# EAGLE design M228X (EAGLE 6.6.0)
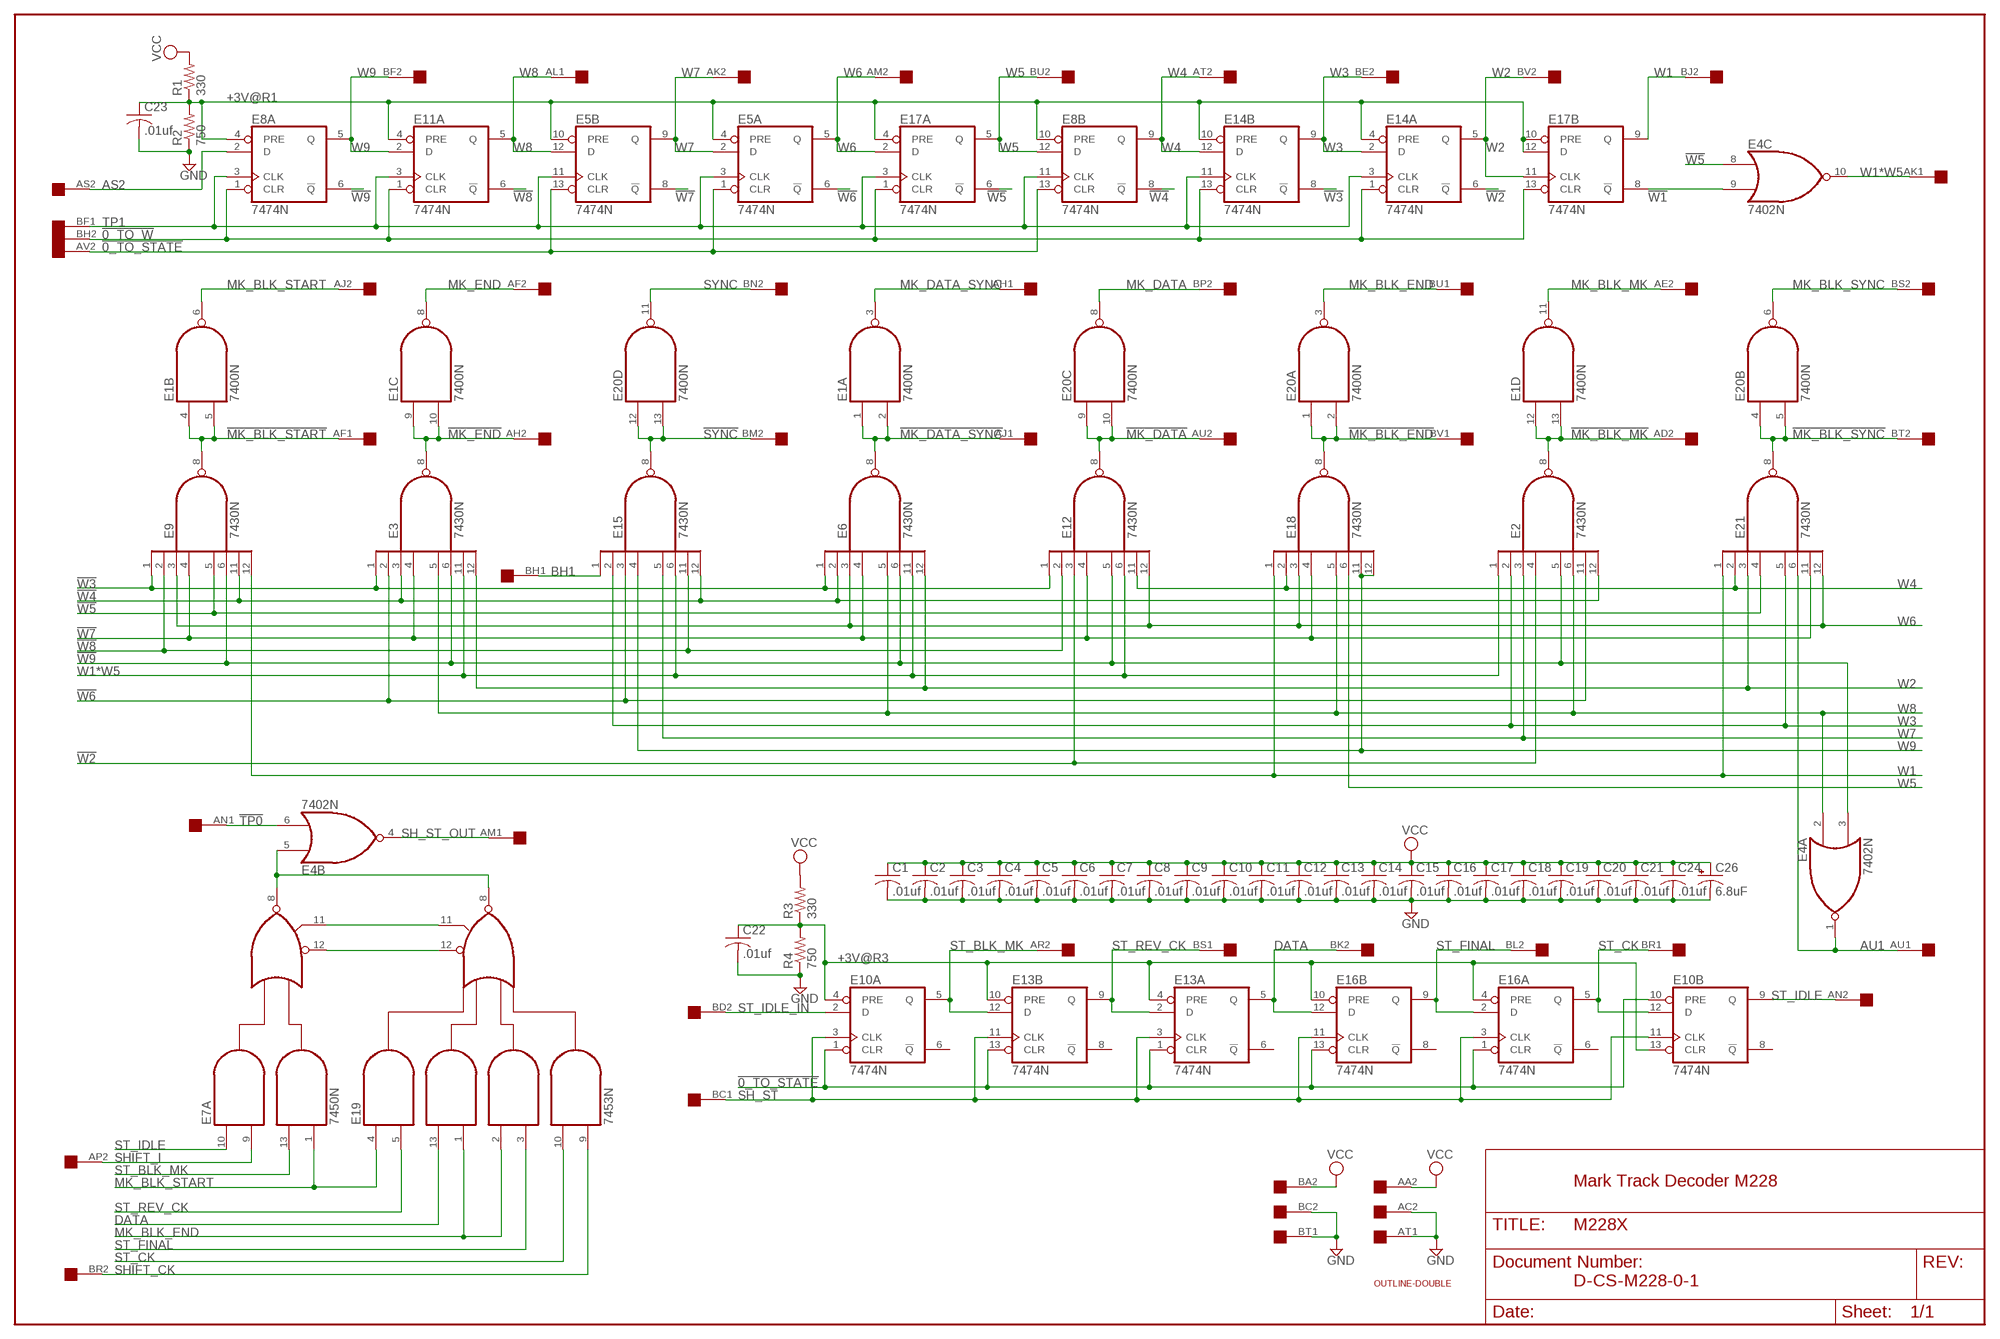
[diagram p0: schematic, sheet 1]

## Parts
C1  .01uf  C-US050-025X075  [C050-025X075]
C2  .01uf  C-US050-025X075  [C050-025X075]
C3  .01uf  C-US050-025X075  [C050-025X075]
C4  .01uf  C-US050-025X075  [C050-025X075]
C5  .01uf  C-US050-025X075  [C050-025X075]
C6  .01uf  C-US050-025X075  [C050-025X075]
C7  .01uf  C-US050-025X075  [C050-025X075]
C8  .01uf  C-US050-025X075  [C050-025X075]
C9  .01uf  C-US050-025X075  [C050-025X075]
C10  .01uf  C-US050-025X075  [C050-025X075]
C11  .01uf  C-US050-025X075  [C050-025X075]
C12  .01uf  C-US050-025X075  [C050-025X075]
C13  .01uf  C-US050-025X075  [C050-025X075]
C14  .01uf  C-US050-025X075  [C050-025X075]
C15  .01uf  C-US050-025X075  [C050-025X075]
C16  .01uf  C-US050-025X075  [C050-025X075]
C17  .01uf  C-US050-025X075  [C050-025X075]
C18  .01uf  C-US050-025X075  [C050-025X075]
C19  .01uf  C-US050-025X075  [C050-025X075]
C20  .01uf  C-US050-025X075  [C050-025X075]
C21  .01uf  C-US050-025X075  [C050-025X075]
C22  .01uf  C-US050-025X075  [C050-025X075]
C23  .01uf  C-US050-025X075  [C050-025X075]
C24  .01uf  C-US050-025X075  [C050-025X075]
C26  6.8uF  CPOL-USE22-6AXIAL  [E22-6]
E1  7400N  [DIL14]
E2  7430N  [DIL14]
E3  7430N  [DIL14]
E4  7402N  [DIL14]
E5  7474N  74S74N  [DIL14]
E6  7430N  [DIL14]
E7  7450N  [DIL14]
E8  7474N  74S74N  [DIL14]
E9  7430N  [DIL14]
E10  7474N  74S74N  [DIL14]
E11  7474N  74S74N  [DIL14]
E12  7430N  [DIL14]
E13  7474N  74S74N  [DIL14]
E14  7474N  74S74N  [DIL14]
E15  7430N  [DIL14]
E16  7474N  74S74N  [DIL14]
E17  7474N  74S74N  [DIL14]
E18  7430N  [DIL14]
E19  7453N  [DIL14]
E20  7400N  [DIL14]
E21  7430N  [DIL14]
R1  330  R-US_0207/10  [0207/10]
R2  750  R-US_0207/10  [0207/10]
R3  330  R-US_0207/10  [0207/10]
R4  750  R-US_0207/10  [0207/10]
U$1  OUTLINE-DOUBLE  [DOUBLE]
U$5  DOUBLE  [EDGE-CON4]

## Nets
!0_TO_STATE: E5.1(A:CLR) E5.13(B:CLR) E8.13(B:CLR) E10.1(A:CLR) E10.10(B:PRE) E13.1(A:CLR) E13.13(B:CLR) E16.1(A:CLR) E16.13(B:CLR) U$5.AV2
!0_TO_W: E8.1(A:CLR) E11.1(A:CLR) E14.1(A:CLR) E14.13(B:CLR) E17.1(A:CLR) E17.13(B:CLR) U$5.BH2
!MK_BLK_END: E18.8(O) E20.1(A:I0) E20.2(A:I1) U$5.BV1
!MK_BLK_MK: E1.12(D:I0) E1.13(D:I1) E2.8(O) U$5.AD2
!MK_BLK_START: E1.4(B:I0) E1.5(B:I1) E9.8(O) U$5.AF1
!MK_BLK_SYNC: E20.4(B:I0) E20.5(B:I1) E21.8(O) U$5.BT2
!MK_DATA: E12.8(O) E20.9(C:I0) E20.10(C:I1) U$5.AU2
!MK_DATA_SYNC: E1.1(A:I0) E1.2(A:I1) E6.8(O) U$5.AJ1
!MK_END: E1.9(C:I0) E1.10(C:I1) E3.8(O) U$5.AH2
!SYNC: E15.8(O) E20.12(D:I0) E20.13(D:I1) U$5.BM2
!TP0: E4.6(B:I1) U$5.AN1
!W1: E4.9(C:I1) E17.8(B:!Q)
!W2: E2.4(I3) E12.3(I2) E14.6(A:!Q)
!W3: E3.1(I0) E6.1(I0) E9.1(I0) E12.1(I0) E14.8(B:!Q)
!W4: E2.12(I7) E3.3(I2) E6.2(I1) E8.8(B:!Q) E9.11(I6) E15.12(I7)
!W5: E4.8(C:I0) E9.5(I4) E17.6(A:!Q) E21.4(I3)
!W6: E2.11(I6) E3.2(I1) E5.6(A:!Q) E15.3(I2)
!W7: E3.4(I3) E5.8(B:!Q) E6.4(I3) E9.4(I3) E12.4(I3) E18.4(I3) E21.11(I6)
!W8: E9.2(I1) E11.6(A:!Q) E12.2(I1) E15.11(I6)
!W9: E2.5(I4) E3.6(I5) E4.3(A:I1) E6.6(I5) E8.6(A:!Q) E9.6(I5) E12.5(I4)
+3V@R1 [Supply]: C23.1 E5.4(A:PRE) E5.10(B:PRE) E8.4(A:PRE) E8.10(B:PRE) E11.4(A:PRE) E14.4(A:PRE) E14.10(B:PRE) E17.4(A:PRE) E17.10(B:PRE) E17.12(B:D) R1.1 R2.2
+3V@R3 [Supply]: C22.1 E10.4(A:PRE) E10.13(B:CLR) E13.4(A:PRE) E13.10(B:PRE) E16.4(A:PRE) E16.10(B:PRE) R3.1 R4.2
AS2: E8.2(A:D) U$5.AS2
AU1: E4.1(A:O) E21.6(I5) U$5.AU1
BH1: E15.1(I0) U$5.BH1
DATA: E13.5(A:Q) E16.12(B:D) E19.13(I3) U$5.BK2
GND [Supply]: C1.2 C2.2 C3.2 C4.2 C5.2 C6.2 C7.2 C8.2 C9.2 C10.2 C11.2 C12.2 C13.2 C14.2 C15.2 C16.2 C17.2 C18.2 C19.2 C20.2 C21.2 C22.2 C23.2 C24.2 C26.- R2.1 R4.1 U$5.AC2 U$5.AT1 U$5.BC2 U$5.BT1
MK_BLK_END: E19.1(I4) E19.2(I5) E20.3(A:O) U$5.BU1
MK_BLK_MK: E1.11(D:O) U$5.AE2
MK_BLK_START: E1.6(B:O) E7.1(A:I4) E19.4(I1) U$5.AJ2
MK_BLK_SYNC: E20.6(B:O) U$5.BS2
MK_DATA: E20.8(C:O) U$5.BP2
MK_DATA_SYNC: E1.3(A:O) U$5.AH1
MK_END: E1.8(C:O) U$5.AF2
N$1: E7.12(A:I5) E19.12(I9)
N$2: E7.11(A:I6) E19.11(I10)
N$3: E4.5(B:I0) E7.8(A:O) E19.8(O)
SH_ST: E10.3(A:CLK) E10.11(B:CLK) E13.3(A:CLK) E13.11(B:CLK) E16.3(A:CLK) E16.11(B:CLK) U$5.BC1
SH_ST_OUT: E4.4(B:O) U$5.AM1
SHIFT_CK: E19.9(I8) U$5.BR2
SHIFT_I: E7.9(A:I2) U$5.AP2
ST_BLK_MK: E7.13(A:I3) E10.5(A:Q) E13.12(B:D) U$5.AR2
ST_CK: E10.12(B:D) E16.5(A:Q) E19.10(I7) U$5.BR1
ST_FINAL: E16.2(A:D) E16.9(B:Q) E19.3(I6) U$5.BL2
ST_IDLE: E7.10(A:I1) E10.9(B:Q) U$5.AN2
ST_IDLE_IN: E10.2(A:D) U$5.BD2
ST_REV_CK: E13.2(A:D) E13.9(B:Q) E19.5(I2) U$5.BS1
SYNC: E20.11(D:O) U$5.BN2
TP1: E5.3(A:CLK) E5.11(B:CLK) E8.3(A:CLK) E8.11(B:CLK) E11.3(A:CLK) E14.3(A:CLK) E14.11(B:CLK) E17.3(A:CLK) U$5.BF1
VCC [Supply]: C1.1 C2.1 C3.1 C4.1 C5.1 C6.1 C7.1 C8.1 C9.1 C10.1 C11.1 C12.1 C13.1 C14.1 C15.1 C16.1 C17.1 C18.1 C19.1 C20.1 C21.1 C24.1 C26.+ R1.2 R3.2 U$5.AA2 U$5.BA2
W1: E9.12(I7) E17.9(B:Q) E18.1(I0) E21.1(I0) U$5.BJ2
W1*W5: E2.1(I0) E3.11(I6) E4.10(C:O) E6.11(I6) E12.6(I5) E15.6(I5) U$5.AK1
W2: E3.12(I7) E6.12(I7) E14.5(A:Q) E17.11(B:CLK) E21.3(I2) U$5.BV2
W3: E2.2(I1) E14.2(A:D) E14.9(B:Q) E15.2(I1) E21.5(I4) U$5.BE2
W4: E8.9(B:Q) E12.11(I6) E14.12(B:D) E18.2(I1) E21.2(I1) U$5.AT2
W5: E8.12(B:D) E17.5(A:Q) E18.6(I5) U$5.BU2
W6: E5.5(A:Q) E6.3(I2) E9.3(I2) E12.12(I7) E17.2(A:D) E18.3(I2) E21.12(I7) U$5.AM2
W7: E2.3(I2) E5.2(A:D) E5.9(B:Q) E15.5(I4) U$5.AK2
W8: E2.6(I5) E3.5(I4) E4.2(A:I0) E5.12(B:D) E6.5(I4) E11.5(A:Q) E18.5(I4) U$5.AL1
W9: E8.5(A:Q) E11.2(A:D) E15.4(I3) E18.11(I6) E18.12(I7) U$5.BF2
Unconnected: E4.11(D:I0) E4.12(D:I1) E4.13(D:O) E7.2(B:I1) E7.3(B:I2) E7.4(B:I3) E7.5(B:I4) E7.6(B:O) E10.6(A:!Q) E10.8(B:!Q) E11.8(B:!Q) E11.9(B:Q) E11.10(B:PRE) E11.11(B:CLK) E11.12(B:D) E11.13(B:CLR) E13.6(A:!Q) E13.8(B:!Q) E16.6(A:!Q) E16.8(B:!Q) U$5.AA1 U$5.AB1 U$5.AB2 U$5.AC1 U$5.AD1 U$5.AE1 U$5.AL2 U$5.AP1 U$5.AR1 U$5.AS1 U$5.AV1 U$5.BA1 U$5.BB1 U$5.BB2 U$5.BD1 U$5.BE1 U$5.BJ1 U$5.BK1 U$5.BL1 U$5.BM1 U$5.BN1 U$5.BP1

## Notes on the sheet
- Mark Track Decoder M228
- D-CS-M228-0-1

## Power pins joined to a net without a drawn wire
GND: E1.7(P:GND) E2.7(GND) E3.7(GND) E4.7(P:GND) E5.7(P:GND) E6.7(GND) E7.7(P:GND) E8.7(P:GND) E9.7(GND) E10.7(P:GND) E11.7(P:GND) E12.7(GND) E13.7(P:GND) E14.7(P:GND) E15.7(GND) E16.7(P:GND) E17.7(P:GND) E18.7(GND) E19.7(GND) E20.7(P:GND) E21.7(GND)
VCC: E1.14(P:VCC) E2.14(VCC) E3.14(VCC) E4.14(P:VCC) E5.14(P:VCC) E6.14(VCC) E7.14(P:VCC) E8.14(P:VCC) E9.14(VCC) E10.14(P:VCC) E11.14(P:VCC) E12.14(VCC) E13.14(P:VCC) E14.14(P:VCC) E15.14(VCC) E16.14(P:VCC) E17.14(P:VCC) E18.14(VCC) E19.14(VCC) E20.14(P:VCC) E21.14(VCC)

## Library data of the parts
C1-C24 = rcl:C-US: CAPACITOR, American symbol
C26 = rcl:CPOL-US: POLARIZED CAPACITOR, American symbol
E1 E20 = 74xx-us:74*00: Quad 2-input NAND gate
E2 E3 E6 E9 E12 E15 E18 E21 = 74xx-us:74*30: 8-input NAND gate
E4 = 74xx-us:74*02: Quad 2-input NOR gate
E5 E8 E10 E11 E13 E14 E16 E17 = 74xx-us:74*74: Dual D type positive edge triggered FLIP FLOP, preset and clear
E7 = dec-con:74*50: 4-2-3-2 input AND OR INVERTER gates
E19 = 74xxN:74*53: 4-2-3-2 input AND OR INVERTER gates
R1-R4 = rcl:R-US_: RESISTOR, American symbol
U$1 = dec-con:OUTLINE-*: Board outlines for DEC boards.
U$5 = dec-con:DOUBLE: Double-Height DEC board

## Net classes
1 Supply: width 0.813 mm

## Board
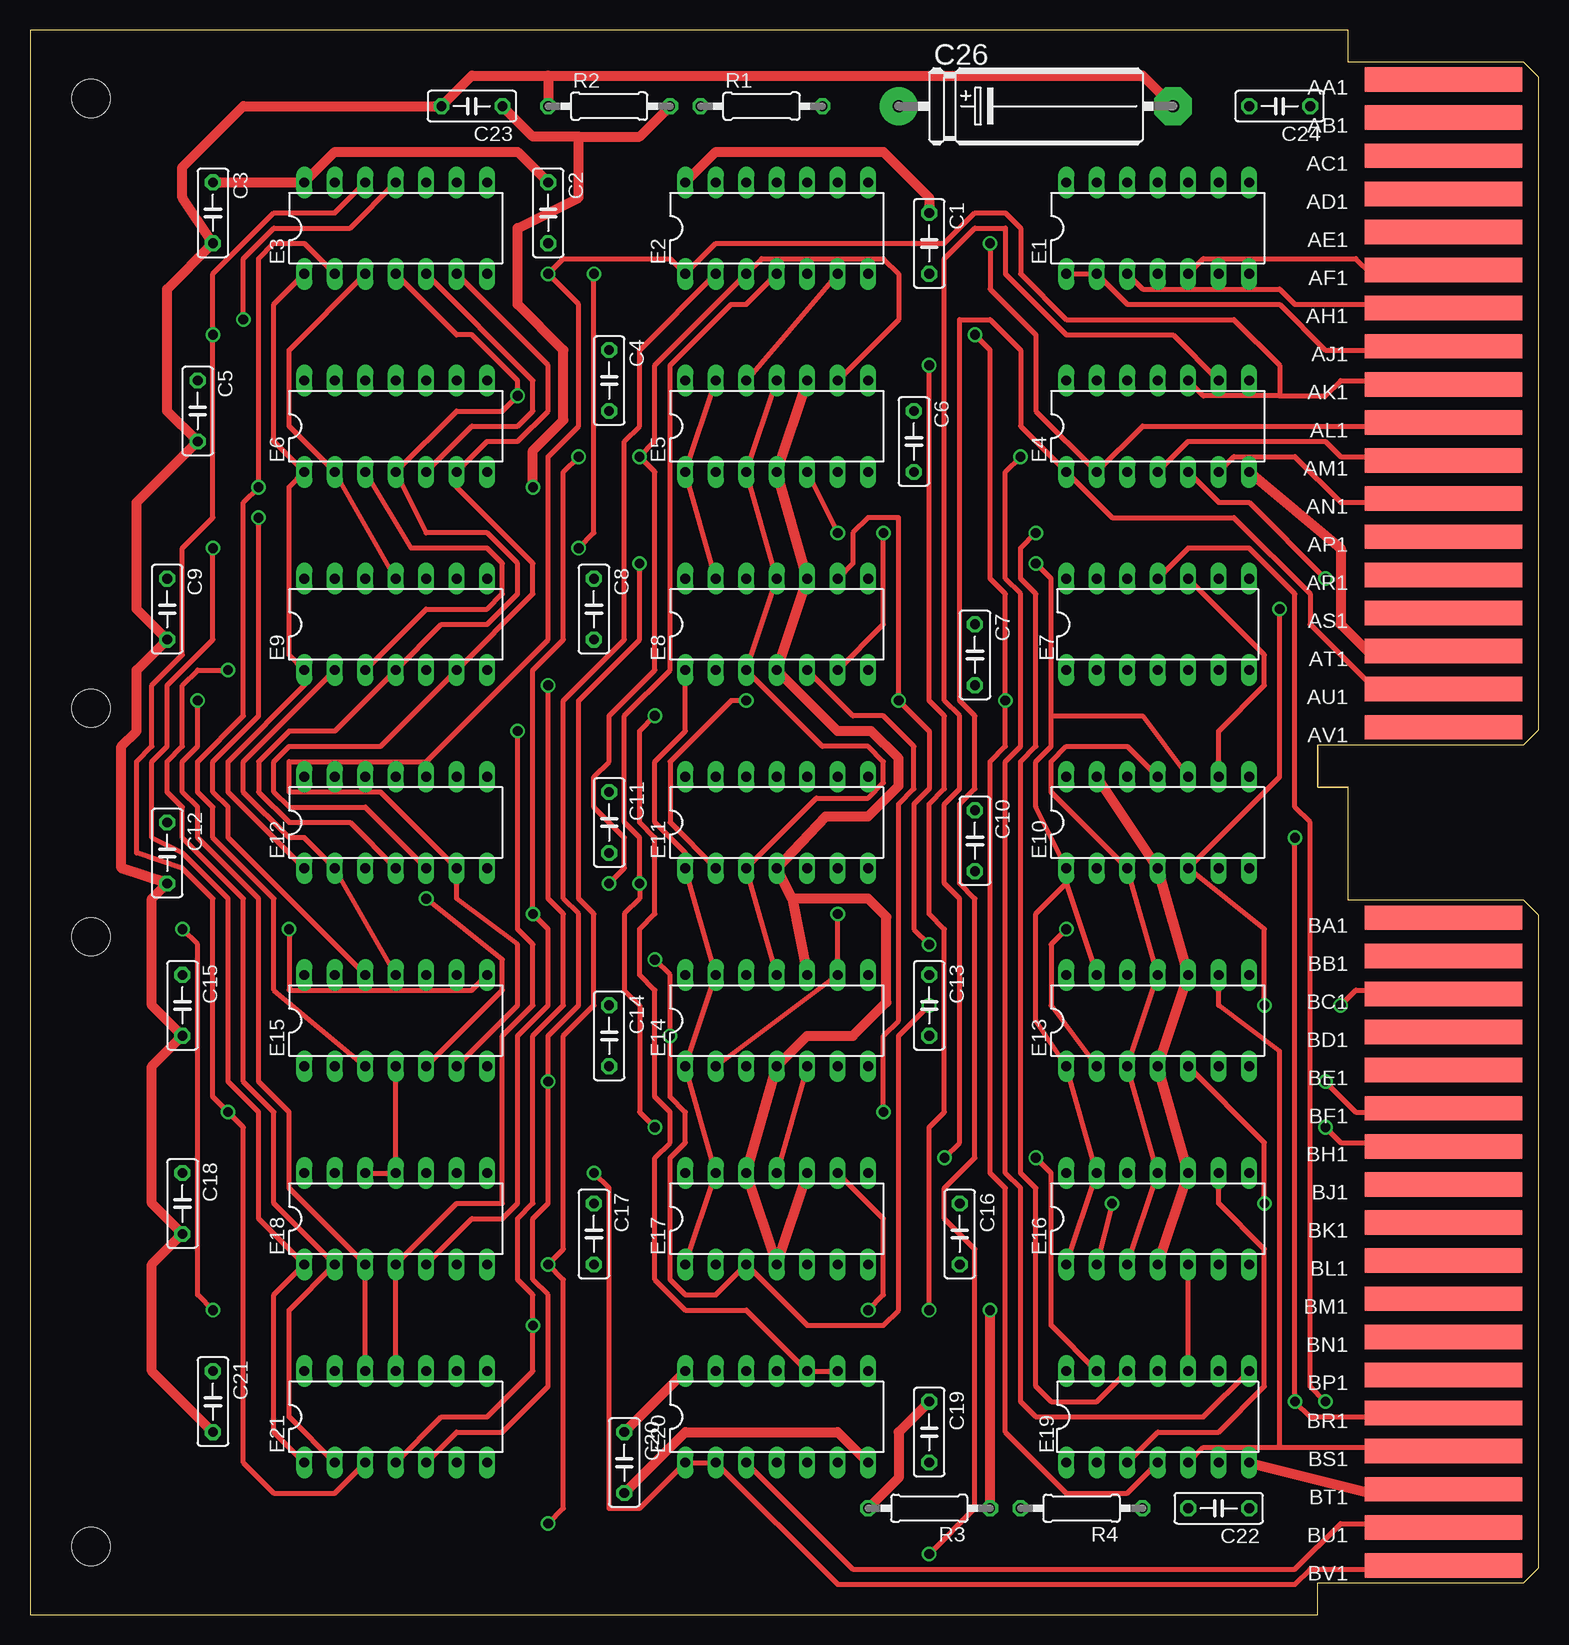
[diagram p1: board, top side]
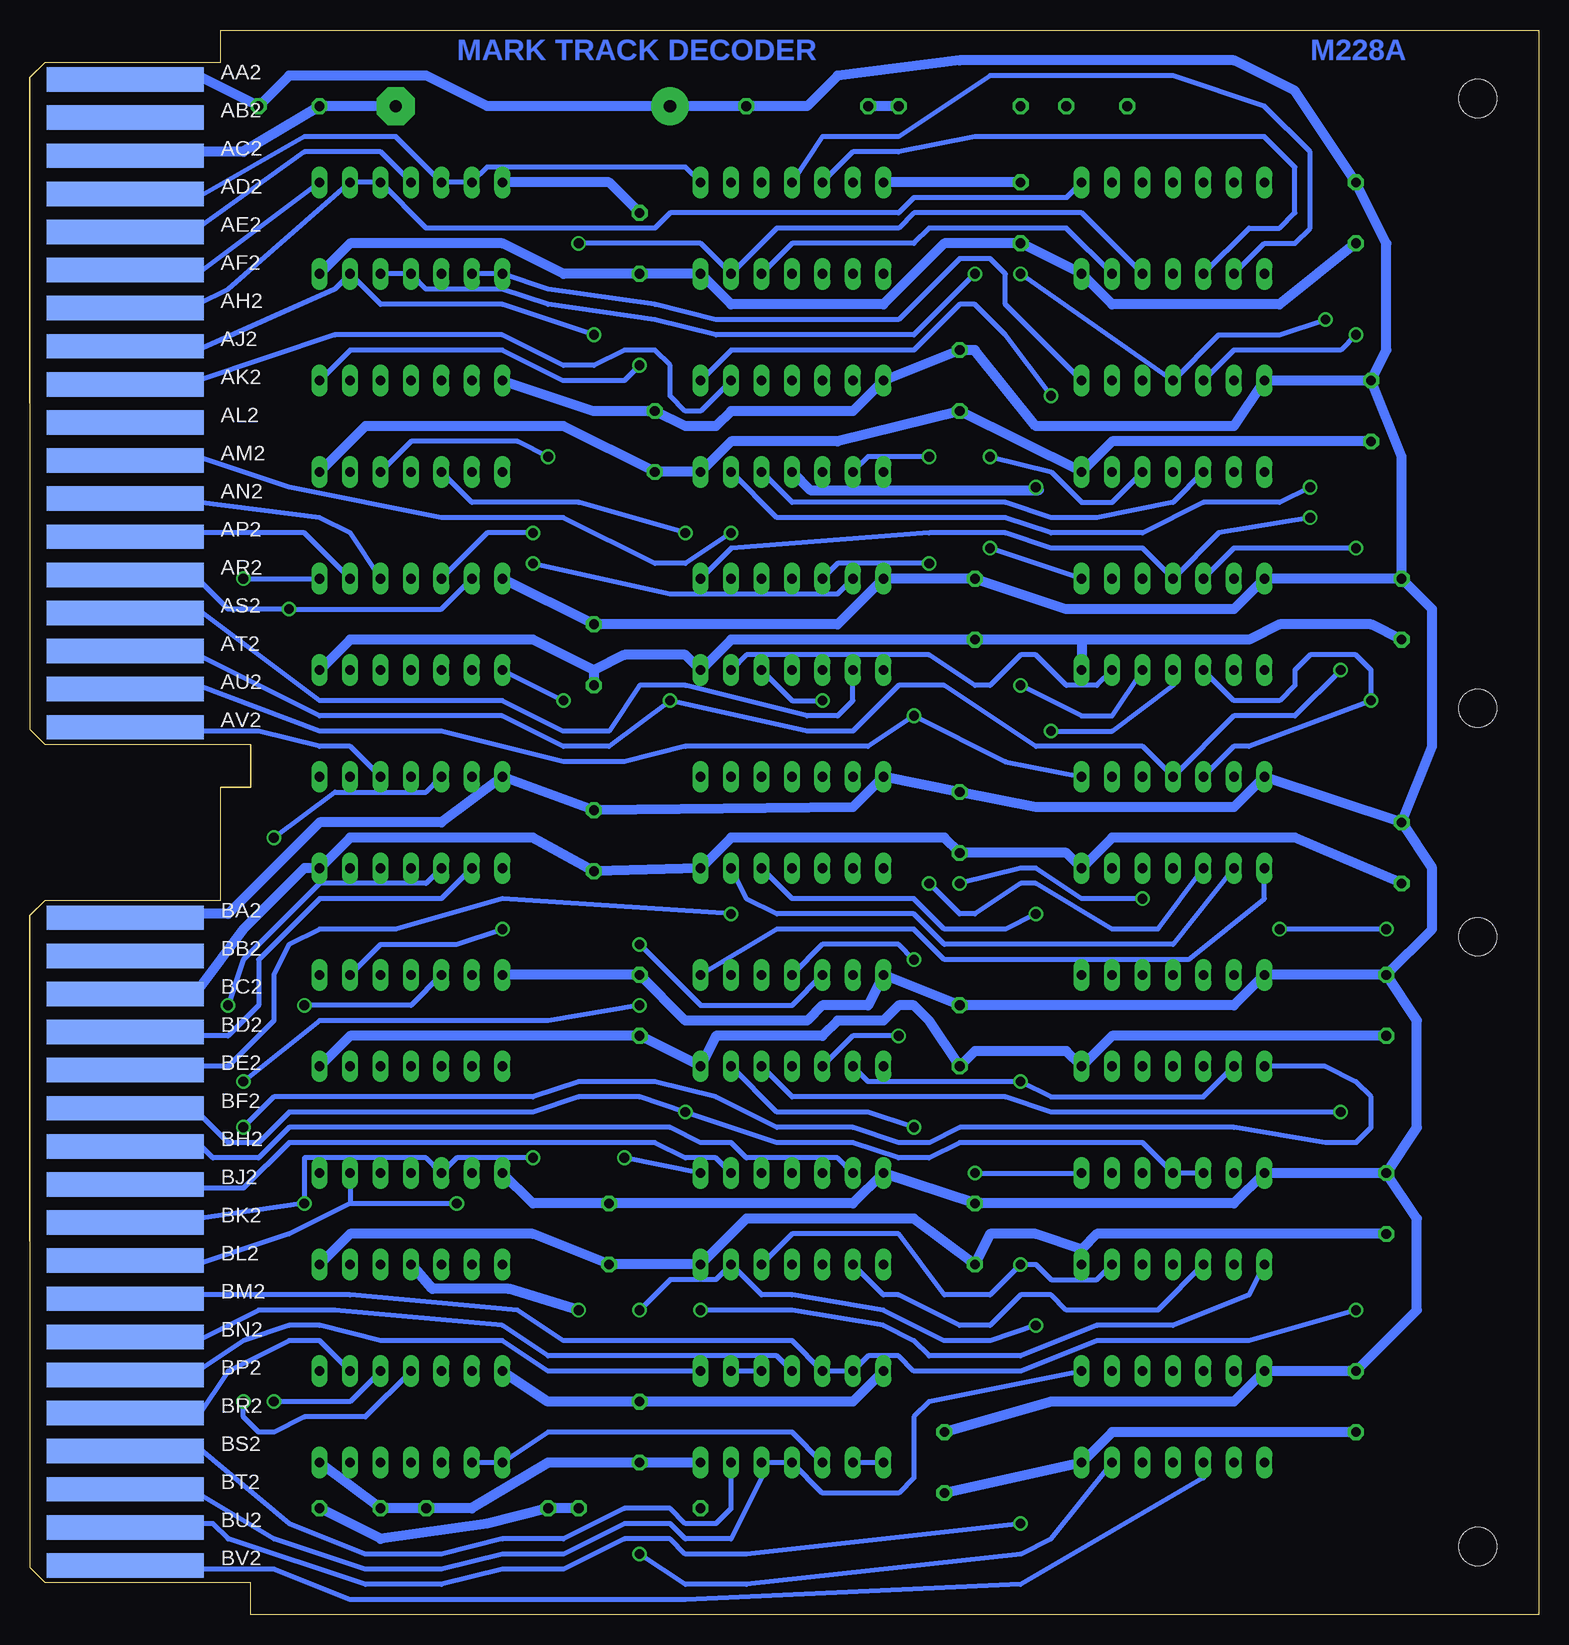
[diagram p2: board, bottom side, seen from below]

Size 125.73 x 132.08 mm. Coordinates in mm from the lower left corner, seen from the top.
Copper layers (1+16): Top 0.035mm / dielectric 1.5mm / Bottom 0.035mm
Design rules "16mils": minimum track width 16mil, minimum drill 32mil, track to track 15mil, track to pad 10mil, pad to pad 10mil, via to via 10mil, smd to smd 10mil, copper to edge 25mil, drill to drill 10mil, minimum pad ring 10mil, minimum via ring 8mil, stop-mask expansion 0mil, vias tented up to drill 0mil, thermal gap 10mil
vRestrict: area 31.8,108 to 41.9,125.7; area 49.5,108 to 59.7,125.7; area 67.3,108 to 77.5,125.7; area 85.1,108 to 95.2,125.7; area 102.9,108 to 113,125.7; area 31.8,80 to 41.9,97.8; area 49.5,80 to 59.7,97.8; area 67.3,80 to 77.5,97.8; area 85.1,80 to 95.2,97.8; area 31.8,34.3 to 41.9,52.1; area 49.5,34.3 to 59.7,52.1; area 67.3,34.3 to 77.5,52.1; area 85.1,34.3 to 95.2,52.1; area 102.9,11.4 to 113,29.2; area 85.1,11.4 to 95.2,29.2; area 49.5,11.4 to 59.7,29.2; area 31.8,11.4 to 41.9,29.2; area 67.3,11.4 to 77.5,29.2

### Footprints (pad centres in the part's own frame; a part is rotated, then mirrored left to right if it is on the bottom)
C050-025X075 = drill 0.813 octagon: 1 -2.54,0; 2 2.54,0
E22-6 = drill 1.016 pad 3.15: + -11.43,0 | drill 1.016 pad 3.15 octagon: - 11.43,0
DIL14 = drill 0.813 long: 1 -7.62,-3.81; 2 -5.08,-3.81; 3 -2.54,-3.81; 4 0,-3.81; 5 2.54,-3.81; 6 5.08,-3.81; 7 7.62,-3.81; 8 7.62,3.81; 9 5.08,3.81; 10 2.54,3.81; 11 0,3.81; 12 -2.54,3.81; 13 -5.08,3.81; 14 -7.62,3.81
0207/10 = drill 0.813 octagon: 1 -5.08,0; 2 5.08,0
DOUBLE = hole 3.175: 120.65,56.515; 120.65,5.715; 120.65,75.565; 120.65,126.365
EDGE-CON4 = smd 13.106 x 2.032: AA1 7.938,4.128; AB1 7.938,7.303; AC1 7.938,10.477; AD1 7.938,13.652; AE1 7.938,16.828; AF1 7.938,20.003; AH1 7.938,23.177; AJ1 7.938,26.352; AK1 7.938,29.527; AL1 7.938,32.703; AM1 7.938,35.877; AN1 7.938,39.053; AP1 7.938,42.227; AR1 7.938,45.403; AS1 7.938,48.578; AT1 7.938,51.752; AU1 7.938,54.928; AV1 7.938,58.102; BA1 7.938,73.978; BB1 7.938,77.153; BC1 7.938,80.328; BD1 7.938,83.502; BE1 7.938,86.677; BF1 7.938,89.853; BH1 7.938,93.028; BJ1 7.938,96.203; BK1 7.938,99.377; BL1 7.938,102.552; BM1 7.938,105.728; BN1 7.938,108.903; BP1 7.938,112.078; BR1 7.938,115.252; BS1 7.938,118.427; BT1 7.938,121.603; BU1 7.938,124.778; BV1 7.938,127.953 | smd 13.106 x 2.032 bottom: AA2 7.938,4.128; AB2 7.938,7.303; AC2 7.938,10.477; AD2 7.938,13.652; AE2 7.938,16.828; AF2 7.938,20.003; AH2 7.938,23.177; AJ2 7.938,26.352; AK2 7.938,29.527; AL2 7.938,32.703; AM2 7.938,35.877; AN2 7.938,39.053; AP2 7.938,42.227; AR2 7.938,45.403; AS2 7.938,48.578; AT2 7.938,51.752; AU2 7.938,54.928; AV2 7.938,58.102; BA2 7.938,73.978; BB2 7.938,77.153; BC2 7.938,80.328; BD2 7.938,83.502; BE2 7.938,86.677; BF2 7.938,89.853; BH2 7.938,93.028; BJ2 7.938,96.203; BK2 7.938,99.377; BL2 7.938,102.552; BM2 7.938,105.728; BN2 7.938,108.903; BP2 7.938,112.078; BR2 7.938,115.252; BS2 7.938,118.427; BT2 7.938,121.603; BU2 7.938,124.778; BV2 7.938,127.953

### Placement (x,y rotation side)
C1  74.93,114.3 270 top
C2  43.18,116.84 270 top
C3  15.24,116.84 270 top
C4  48.26,102.87 270 top
C5  13.97,100.33 270 top
C6  73.66,97.79 270 top
C7  78.74,80.01 270 top
C8  46.99,83.82 270 top
C9  11.43,83.82 270 top
C10  78.74,64.52 270 top
C11  48.26,66.04 270 top
C12  11.43,63.5 270 top
C13  74.93,50.8 270 top
C14  48.26,48.26 270 top
C15  12.7,50.8 270 top
C16  77.47,31.75 270 top
C17  46.99,31.75 270 top
C18  12.7,34.29 270 top
C19  74.93,15.24 270 top
C20  49.53,12.7 270 top
C21  15.24,17.78 270 top
C22  99.06,8.89 180 top
C23  36.83,125.73 180 top
C24  104.14,125.73 180 top
C26  83.82,125.73 0 top
E1  93.98,115.57 0 top
E2  62.23,115.57 0 top
E3  30.48,115.57 0 top
E4  93.98,99.06 0 top
E5  62.23,99.06 0 top
E6  30.48,99.06 0 top
E7  93.98,82.55 0 top
E8  62.23,82.55 0 top
E9  30.48,82.55 0 top
E10  93.98,66.04 0 top
E11  62.23,66.04 0 top
E12  30.48,66.04 0 top
E13  93.98,49.53 0 top
E14  62.23,49.53 0 top
E15  30.48,49.53 0 top
E16  93.98,33.02 0 top
E17  62.23,33.02 0 top
E18  30.48,33.02 0 top
E19  93.98,16.51 0 top
E20  62.23,16.51 0 top
E21  30.48,16.51 0 top
R1  60.96,125.73 0 top
R2  48.26,125.73 0 top
R3  74.93,8.89 180 top
R4  87.63,8.89 180 top
U$1  125.73,132.08 180 top
U$5  125.73,132.08 180 top

### Tracks (layer width: path | path; a pad name or v marks a point on that pad's centre or on a via)
!0_TO_STATE  (via drill 0.81)
  Top 0.406: E8.13 E5.1 E5.13 | 86.36,60.96 E13.13 | 86.36,60.96 E10.1 83.82,67.31 83.82,71.12 85.09,72.39 85.09,74.93 | E16.1 E16.13 E13.1 83.82,49.53 83.82,58.42 86.36,60.96 | 85.09,74.93 85.09,86.36 v83.82,87.63 | E10.10 92.71,74.93 85.09,74.93
  Bottom 0.406: E8.13 58.42,85.09 72.39,85.09 v83.82,87.63 | U$5.AV2 116.84,73.66 106.68,73.66 101.6,72.39 99.06,72.39 E10.10
!0_TO_W
  Top 0.406: E17.1 E17.13 E14.1 E14.13 E11.1 54.61,63.5 52.07,66.04 52.07,71.12 54.61,73.66 E8.1
  Bottom 0.406: U$5.BH2 116.84,39.37 111.76,39.37 110.49,38.1 106.68,38.1 104.14,40.64 72.39,40.64 69.85,39.37 67.31,39.37 66.04,38.1 58.42,38.1 E17.13
!MK_BLK_END  (via drill 0.81)
  Top 0.406: U$5.BV1 116.84,3.81 106.68,3.81 105.41,2.54 67.31,2.54 E20.2 E20.1 50.8,8.89 48.26,8.89 48.26,35.56 v46.99,36.83
  Bottom 0.406: v46.99,36.83 E18.8 | E20.1 E20.2
!MK_BLK_MK
  Bottom 0.406: E2.8 71.12,120.65 87.63,120.65 E1.13 E1.12 95.25,123.19 102.87,123.19 111.76,118.11 116.84,118.11 U$5.AD2
!MK_BLK_START  (via drill 0.81)
  Top 0.406: U$5.AF1 116.84,111.76 111.76,111.76 110.49,113.03 97.79,113.03 E1.5 | v45.72,88.9 46.99,90.17 v46.99,111.76
  Bottom 0.406: E1.5 E1.4 92.71,110.49 86.36,110.49 82.55,109.22 73.66,107.95 68.58,106.68 52.07,106.68 v46.99,111.76 | E9.8 v45.72,88.9
!MK_BLK_SYNC
  Bottom 0.406: U$5.BT2 117.17,10.49 116.84,10.16 111.76,10.16 105.41,6.35 97.79,3.81 91.44,3.81 86.36,5.08 81.28,5.08 76.2,7.62 72.39,7.62 71.12,6.35 67.31,6.35 64.77,11.43 E20.5 E20.4 59.69,10.16 53.34,10.16 52.07,11.43 52.07,16.51 50.8,17.78 E21.8
!MK_DATA  (via drill 0.81)
  Top 0.406: E20.9 E20.10 59.69,25.4 54.61,25.4 52.07,27.94 52.07,38.1 53.34,39.37 53.34,41.91 52.07,43.18 52.07,52.07 50.8,53.34 50.8,57.15 52.07,58.42 52.07,64.77 50.8,66.04 50.8,73.66 v52.07,74.93
  Bottom 0.406: E20.10 E20.9 | U$5.AU2 116.84,77.47 111.76,77.47 101.6,73.66 91.44,73.66 81.28,71.12 76.2,71.12 71.12,72.39 55.88,72.39 v52.07,74.93 44.45,71.12 E12.8
!MK_DATA_SYNC
  Top 0.406: E1.1 E1.2 91.44,109.22 104.14,109.22 107.95,105.41 116.84,105.41 U$5.AJ1
  Bottom 0.406: E6.8 44.45,109.22 44.45,111.76 45.72,113.03 48.26,113.03 53.34,107.95 68.58,107.95 73.66,109.22 82.55,110.49 E1.1 E1.2
!MK_END
  Bottom 0.406: E3.8 39.37,118.11 52.07,118.11 53.34,116.84 72.39,116.84 73.66,115.57 92.71,115.57 E1.10 E1.9 109.22,110.49 111.76,109.22 116.84,109.22 U$5.AH2
!SYNC  (via drill 0.81)
  Top 0.406: v15.24,25.4 13.97,26.67 13.97,55.88 v12.7,57.15 | E15.8 36.83,52.07 21.59,52.07 v21.59,57.15
  Bottom 0.406: U$5.BM2 116.84,26.67 99.06,26.67 85.09,25.4 81.28,22.86 62.23,22.86 E20.12 E20.13 55.88,21.59 53.34,21.59 52.07,20.32 43.18,20.32 36.83,22.86 24.13,22.86 v15.24,25.4 | v12.7,57.15 v21.59,57.15
!TP0
  Top 0.406: U$5.AN1 116.84,92.71 109.22,92.71 105.41,96.52 100.33,96.52 E4.6
!W1  (via drill 0.81)
  Top 0.406: E4.9 95.25,106.68 86.36,106.68 81.28,111.76 81.28,115.57 78.74,115.57 76.2,113.03 76.2,76.2 77.47,74.93 77.47,68.83 76.2,67.56 76.2,60.96 77.47,59.69 77.47,39.37 v76.2,38.1
  Bottom 0.406: E17.8 v76.2,38.1
!W2  (via drill 0.81)
  Top 0.406: E2.4 59.69,109.22 58.42,109.22 53.34,104.14 53.34,78.74 49.53,74.93 49.53,66.04 50.8,64.77 v50.8,60.96 50.8,59.69 49.53,58.42 49.53,52.07 50.8,50.8 50.8,41.91 v52.07,40.64
  Bottom 0.406: E14.6 63.5,41.91 55.88,41.91 v52.07,40.64 | E12.3 31.75,57.15 35.56,57.15 41.91,60.96 43.18,60.96 46.99,58.42 48.26,58.42 v50.8,60.96
!W3
  Top 0.406: E3.1 20.32,109.22 20.32,97.79 E6.1 21.59,93.98 21.59,80.01 E9.1 22.86,77.47 16.51,71.12 16.51,68.58 E12.1
  Bottom 0.406: E12.1 22.86,59.69 29.21,54.61 49.53,54.61 52.07,57.15 63.5,57.15 E14.8
!W4  (via drill 0.81)
  Top 0.406: E9.11 E6.2 21.59,99.06 21.59,105.41 E3.3 | E15.12 16.51,64.77 16.51,67.31 15.24,68.58 15.24,71.12 19.05,74.93 v19.05,91.44
  Bottom 0.406: E2.12 57.15,121.92 53.34,121.92 46.99,123.19 22.86,123.19 20.32,120.65 20.32,116.84 21.59,115.57 24.13,115.57 E3.3 | E8.8 67.31,88.9 50.8,90.17 44.45,90.17 40.64,88.9 33.02,88.9 E9.11 26.67,90.17 v19.05,91.44
!W5  (via drill 0.81)
  Top 0.406: E21.4 34.29,16.51 38.1,16.51 41.91,20.32 v41.91,24.13 41.91,26.67 40.64,27.94 40.64,33.02 41.91,34.29 41.91,48.26 44.45,50.8 44.45,58.42 43.18,59.69 v43.18,77.47 | v74.93,25.4 74.93,40.64 76.2,41.91 76.2,57.15 74.93,58.42 74.93,67.56 76.2,68.83 76.2,74.93 74.93,76.2 v74.93,104.14
  Bottom 0.406: v74.93,25.4 72.39,27.94 68.58,27.94 E17.6 64.77,26.67 62.23,26.67 54.61,25.4 49.53,22.86 45.72,22.86 v41.91,24.13 | E4.8 99.06,105.41 86.36,105.41 81.28,102.87 76.2,102.87 v74.93,104.14 | E9.5 35.56,74.93 38.1,74.93 v43.18,77.47
!W6  (via drill 0.81)
  Top 0.406: E15.3 20.32,52.07 20.32,59.69 15.24,64.77 15.24,67.31 13.97,68.58 13.97,71.12 17.78,74.93 17.78,92.71 v19.05,93.98 19.05,113.03 20.32,114.3 22.86,114.3 E3.2
  Bottom 0.406: E3.2 22.86,114.3 20.32,114.3 19.05,115.57 19.05,121.92 22.86,125.73 30.48,128.27 45.72,128.27 53.34,123.19 59.69,123.19 E2.11 | E5.6 63.5,91.44 44.45,91.44 40.64,90.17 33.02,90.17 27.94,92.71 21.59,92.71 v19.05,93.98
!W7  (via drill 0.81)
  Top 0.406: E21.11 E18.4 35.56,34.29 39.37,34.29 39.37,48.26 41.91,50.8 41.91,55.88 40.64,57.15 v40.64,73.66 | E12.4 26.67,66.04 21.59,66.04 19.05,68.58 19.05,71.12 21.59,73.66 25.4,73.66 E9.4 34.29,82.55 38.1,82.55 40.64,85.09 40.64,87.63 38.1,90.17 33.02,90.17 E6.4 35.56,100.33 39.37,100.33 v40.64,101.6 40.64,102.87 36.83,106.68 35.56,106.68 E3.4
  Bottom 0.406: E9.4 30.48,77.47 35.56,73.66 v40.64,73.66 | E5.8 67.31,105.41 52.07,105.41 48.26,109.22 46.99,109.22 44.45,106.68 v40.64,101.6
!W8
  Top 0.406: E15.11 E12.2 22.86,64.77 21.59,64.77 17.78,68.58 17.78,71.12 E9.2
  Bottom 0.406: E12.2 30.48,55.88 49.53,55.88 52.07,58.42 63.5,58.42 66.04,59.69 E11.6
!W9  (via drill 0.81)
  Top 0.406: E3.6 43.18,104.14 43.18,100.33 40.64,97.79 38.1,97.79 E6.6 35.56,93.98 41.91,87.63 41.91,85.09 E9.6 29.21,72.39 21.59,72.39 20.32,71.12 20.32,68.58 21.59,67.31 27.94,67.31 E12.5 | v71.12,90.17 71.12,82.55 E8.6
  Bottom 0.406: E2.5 62.23,114.3 52.07,114.3 50.8,115.57 39.37,115.57 E3.6 | E4.3 88.9,92.71 80.01,92.71 v71.12,90.17 | E8.6 66.04,80.01 50.8,80.01 46.99,77.47 45.72,77.47 43.18,80.01 41.91,80.01 39.37,77.47 36.83,77.47 E9.6
+3V@R1  (via drill 0.81)
  Top 0.813: 63.5,59.69 E14.10 | 63.5,59.69 E11.4 66.29,66.55 69.85,66.55 72.39,69.09 72.39,71.37 70.1,73.66 67.31,73.66 E8.4 E8.10 E5.4 E5.10 | E17.10 E17.4 E17.12 E14.4 64.77,48.26 68.58,48.26 71.37,51.05 71.37,58.17 69.85,59.69 63.5,59.69 | C23.1 41.91,123.19 45.72,123.19 | 45.72,123.19 50.8,123.19 R2.2 | v41.91,93.98 41.91,97.03 44.45,99.57 44.45,105.41 40.64,109.22 40.64,115.57 45.72,118.11 45.72,123.19
  Bottom 0.813: R2.2 R1.1 | E5.4 60.71,93.73 41.66,93.73 v41.91,93.98
+3V@R3  (via drill 0.81)
  Top 0.813: E16.4 E16.10 E13.4 E13.10 E10.4 E10.13 | R3.1 v80.01,25.4
  Bottom 0.813: R3.1 R4.2 87.63,7.62 96.52,6.35 C22.1 | E16.4 92.2,27.18 85.85,27.18 v80.01,25.4
AS2
  Bottom 0.406: E8.2 57.15,76.2 58.42,74.93 60.96,74.93 71.12,77.47 74.93,77.47 77.47,73.66 81.28,73.66 86.36,76.2 101.6,76.2 111.76,83.82 116.84,83.82 U$5.AS2
AU1  (via drill 0.81)
  Top 0.406: U$5.AU1 116.84,77.47 111.76,77.47 106.68,82.55 106.68,85.09 100.33,91.44 90.17,91.44 E4.1 82.55,99.06 82.55,105.41 80.01,107.95 77.47,107.95 77.47,76.2 78.74,74.93 78.74,68.83 77.47,67.56 77.47,60.96 78.74,59.69 78.74,38.1 76.2,35.56 76.2,33.02 78.74,30.48 78.74,8.89 v74.93,5.08
  Bottom 0.406: E21.6 40.64,6.35 43.18,5.08 66.04,2.54 71.12,2.54 v74.93,5.08
BH1  (via drill 0.81)
  Top 0.406: U$5.BH1 116.84,39.37 109.22,39.37 v107.95,40.64
  Bottom 0.406: E15.1 17.78,45.72 15.24,44.45 13.97,43.18 13.97,40.64 15.24,39.37 17.78,39.37 25.4,40.64 48.26,40.64 50.8,39.37 53.34,39.37 57.15,40.64 63.5,40.64 68.58,43.18 73.66,44.45 80.01,44.45 83.82,43.18 105.41,43.18 v107.95,40.64
DATA  (via drill 0.81)
  Top 0.406: E19.13 85.09,24.13 85.09,36.83 v83.82,38.1 | E13.5 102.87,39.37 v102.87,34.29
  Bottom 0.406: U$5.BK2 116.84,33.02 111.76,33.02 v102.87,34.29 102.87,38.1 92.71,38.1 E16.12 90.17,38.1 v83.82,38.1
GND
  Top 0.813: U$5.BT1 116.84,10.16 111.76,10.16 E19.7 | U$5.AT1 116.84,80.01 111.76,80.01 109.22,82.55 109.22,88.9 E4.7 | C21.2 10.16,20.32 10.16,29.21 C18.2 10.16,34.29 10.16,45.72 C15.2 10.16,50.8 10.16,59.69 C12.2 7.62,62.23 7.62,72.39 8.89,73.66 8.89,78.74 C9.2 8.89,83.82 8.89,92.71 C5.2 11.43,100.33 11.43,110.49 C3.2 12.7,118.11 12.7,120.65 17.78,125.73 C23.2 36.83,128.27 43.18,128.27 | 43.18,128.27 92.71,128.27 C26.- | 43.18,128.27 R2.1 | E20.7 67.31,15.24 54.61,15.24 C20.2
  Bottom 0.813: C21.2 35.56,15.24 E21.7 C20.2 | E20.7 C19.2 82.55,12.7 88.9,8.89 R4.1 C22.2 E19.7 | E16.7 99.06,31.75 83.82,31.75 C16.2 E17.7 66.04,33.02 52.07,33.02 C17.2 45.72,31.75 41.91,31.75 38.1,30.48 | 38.1,30.48 E18.7 | C18.2 36.83,31.75 38.1,30.48 | C15.2 35.56,48.26 E15.7 39.37,46.99 46.99,46.99 C14.2 50.8,49.53 52.07,50.8 53.34,50.8 54.61,49.53 58.42,49.53 59.69,48.26 68.58,48.26 E14.7 C13.2 99.06,48.26 E13.7 | C12.2 20.32,64.77 35.56,64.77 E12.7 39.37,63.5 C11.2 49.53,64.77 67.31,64.77 E11.7 C10.2 83.82,64.77 99.06,64.77 E10.7 102.87,62.23 107.95,57.15 111.76,52.07 116.84,52.07 U$5.BC2 | C9.2 13.97,82.55 21.59,82.55 24.13,81.28 38.1,81.28 | 38.1,81.28 C8.2 67.31,81.28 E8.7 71.12,80.01 76.2,80.01 78.74,78.74 | 38.1,81.28 E9.7 | E7.7 99.06,81.28 83.82,81.28 78.74,78.74 | 78.74,78.74 C7.2 | C5.2 35.56,97.79 E6.7 C4.2 58.42,97.79 67.31,97.79 E5.7 C6.2 81.28,99.06 97.79,99.06 E4.7 | C3.2 21.59,109.22 35.56,109.22 E3.7 C2.2 49.53,114.3 54.61,109.22 67.31,109.22 E2.7 C1.2 81.28,111.76 86.36,114.3 99.06,114.3 E1.7 | C26.- C24.2 107.95,121.92 116.84,121.92 U$5.AC2
MK_BLK_END
  Top 0.406: U$5.BU1 116.84,7.62 109.22,7.62 105.41,3.81 68.58,3.81 E20.3
  Bottom 0.406: E20.3 62.23,15.24 82.55,15.24 E19.1 E19.2
MK_BLK_MK
  Bottom 0.406: U$5.AE2 116.84,115.57 111.76,115.57 102.87,121.92 96.52,121.92 E1.11
MK_BLK_START  (via drill 0.81)
  Top 0.406: E19.4 91.44,10.16 86.36,10.16 81.28,15.24 81.28,35.56 80.01,36.83 80.01,71.12 81.28,72.39 v81.28,76.2 81.28,85.09 80.01,86.36 80.01,105.41 v78.74,106.68
  Bottom 0.406: U$5.AJ2 116.84,105.41 111.76,105.41 100.33,110.49 E1.6 96.52,109.22 86.36,109.22 v78.74,106.68 | v81.28,76.2 E7.1
MK_BLK_SYNC
  Bottom 0.406: U$5.BS2 116.84,13.97 111.76,13.97 104.14,7.62 97.79,5.08 91.44,5.08 86.36,6.35 81.28,6.35 76.2,8.89 72.39,8.89 71.12,7.62 68.58,7.62 67.31,8.89 E20.6
MK_DATA
  Bottom 0.406: E20.8 82.55,20.32 86.36,22.86 96.52,22.86 101.6,24.13 104.14,24.13 107.95,22.86 111.76,20.32 116.84,20.32 U$5.BP2
MK_DATA_SYNC
  Top 0.406: E1.3 92.71,110.49 104.14,110.49 105.41,109.22 116.84,109.22 U$5.AH1
MK_END
  Bottom 0.406: U$5.AF2 116.84,111.76 111.76,111.76 E1.8
N$1  (via drill 0.81)
  Top 0.406: v83.82,90.17 82.55,88.9 82.55,86.36 83.82,85.09 83.82,72.39 82.55,71.12 82.55,36.83 83.82,35.56 83.82,19.05 85.09,17.78 88.9,17.78 E19.12
  Bottom 0.406: E7.12 87.63,90.17 v83.82,90.17
N$2  (via drill 0.81)
  Top 0.406: v107.95,17.78 106.68,19.05 106.68,66.04 105.41,67.31 105.41,85.09 101.6,88.9 96.52,88.9 E7.11
  Bottom 0.406: E19.11 97.79,16.51 102.87,16.51 105.41,15.24 106.68,15.24 107.95,16.51 v107.95,17.78
N$3  (via drill 0.81)
  Top 0.406: E4.5 99.06,92.71 101.6,92.71 v107.95,86.36 | v82.55,96.52 81.28,95.25 81.28,86.36 82.55,85.09 82.55,72.39 81.28,71.12 81.28,36.83 82.55,35.56 82.55,17.78 83.82,16.51 97.79,16.51 E19.8
  Bottom 0.406: v107.95,86.36 E7.8 | E4.5 93.98,97.79 85.09,97.79 v82.55,96.52
SH_ST  (via drill 0.81)
  Top 0.406: E16.3 E16.11 E13.3 E13.11 E10.3 85.09,68.58 85.09,71.12 86.36,72.39 91.44,72.39 E10.11 | U$5.BC1 116.84,52.07 111.76,52.07 110.49,52.07 v109.22,50.8
  Bottom 0.406: E10.3 92.71,60.96 101.6,60.96 107.95,54.61 v109.22,50.8
SH_ST_OUT
  Top 0.406: U$5.AM1 116.84,96.52 109.22,96.52 107.95,97.79 96.52,97.79 E4.4
SHIFT_CK
  Bottom 0.406: E19.9 101.6,22.86 104.14,22.86 109.22,20.32 111.76,16.51 116.84,16.51 U$5.BR2
SHIFT_I
  Bottom 0.406: U$5.AP2 116.84,90.17 102.87,90.17 E7.9
ST_BLK_MK  (via drill 0.81)
  Top 0.406: v104.14,83.82 104.14,69.85 E10.5 102.87,57.15 v102.87,50.8
  Bottom 0.406: U$5.AR2 116.84,86.36 111.76,86.36 109.22,83.82 v104.14,83.82 91.44,83.82 E7.13 | E13.12 93.98,50.8 v102.87,50.8
ST_CK  (via drill 0.81)
  Top 0.406: U$5.BR1 116.84,16.51 106.68,16.51 v105.41,17.78 v105.41,64.77 | E19.10 E16.5
  Bottom 0.406: E19.10 99.06,17.78 v105.41,17.78 | E10.12 92.71,68.58 100.33,68.58 v105.41,64.77
ST_FINAL  (via drill 0.81)
  Top 0.406: E19.3 93.98,15.24 99.06,15.24 102.87,19.05 102.87,30.48 99.06,34.29 E16.9 | v90.17,34.29 E16.2
  Bottom 0.406: U$5.BL2 116.84,29.21 111.76,29.21 104.14,31.75 99.06,34.29 | E16.9 99.06,34.29 | 99.06,34.29 v90.17,34.29
ST_IDLE
  Top 0.406: E7.10 102.87,80.01 102.87,77.47 99.06,73.66 E10.9
  Bottom 0.406: U$5.AN2 116.84,92.71 111.76,92.71 101.6,91.44 99.06,90.17 E7.10
ST_IDLE_IN
  Bottom 0.406: E10.2 91.44,59.69 101.6,59.69 106.68,54.61 106.68,50.8 109.22,48.26 116.84,48.26 U$5.BD2
ST_REV_CK  (via drill 0.81)
  Top 0.406: U$5.BS1 116.84,13.97 104.14,13.97 | 104.14,13.97 97.79,13.97 E19.5 | E13.2 85.09,50.8 85.09,55.88 v86.36,57.15 | E13.9 99.06,50.8 104.14,46.99 104.14,13.97
  Bottom 0.406: E13.9 96.52,55.88 90.17,55.88 v86.36,57.15
SYNC
  Bottom 0.406: E20.11 63.5,21.59 82.55,21.59 86.36,24.13 100.33,25.4 106.68,25.4 111.76,22.86 116.84,22.86 U$5.BN2
TP1  (via drill 0.81)
  Top 0.406: E14.11 E11.3 65.53,68.07 69.85,68.07 71.12,69.34 71.12,71.12 69.85,72.39 66.04,72.39 E8.3 E8.11 E5.3 E5.11 | v74.93,50.8 72.39,48.26 72.39,25.4 71.12,24.13 64.77,24.13 E17.3 57.15,26.67 54.61,26.67 53.34,27.94 53.34,38.1 54.61,39.37 54.61,41.91 53.34,43.18 v53.34,48.26 53.34,53.34 v52.07,54.61 | U$5.BF1 116.84,41.91 110.49,41.91 v107.95,44.45
  Bottom 0.406: E14.3 57.15,48.26 v53.34,48.26 | v74.93,50.8 82.55,49.53 101.6,49.53 v107.95,44.45 | E14.11 59.69,55.88 53.34,55.88 v52.07,54.61
VCC
  Top 0.813: C3.1 E3.14 25.4,121.92 40.64,121.92 C2.1 | E2.14 57.15,121.92 71.12,121.92 74.93,118.11 C1.1 | R3.2 72.39,11.43 72.39,15.24 C19.1 | C20.1 E20.14
  Bottom 0.813: C20.1 40.64,17.78 25.4,17.78 E21.14 C21.1 10.16,25.4 10.16,33.02 C18.1 | E20.14 57.15,17.78 C19.1 82.55,17.78 E19.14 | C18.1 E18.14 25.4,34.29 C17.1 E17.14 57.15,34.29 C16.1 83.82,34.29 E16.14 | C15.1 10.16,49.53 10.16,40.64 C18.1 | C5.1 12.7,105.41 12.7,114.3 C3.1 20.32,127 25.4,129.54 48.26,129.54 58.42,128.27 60.96,125.73 R1.2 C26.+ 87.63,125.73 92.71,128.27 104.14,128.27 C24.1 111.76,128.27 116.84,128.27 U$5.AA2 | C5.1 11.43,96.52 C9.1 | C9.1 8.89,83.82 8.89,72.39 C12.1 | C12.1 8.89,62.23 8.89,57.15 C15.1 | E13.14 C13.1 71.12,49.53 60.96,49.53 59.69,50.8 55.88,50.8 E14.14 C14.1 25.4,50.8 E15.14 C15.1 | C12.1 E12.14 25.4,67.31 41.91,67.31 C11.1 E11.14 57.15,67.31 C10.1 E10.14 91.44,66.04 101.6,66.04 109.22,58.42 116.84,58.42 U$5.BA2 | C9.1 E9.14 25.4,83.82 39.37,83.82 C8.1 E8.14 58.42,82.55 C7.1 E7.14 | E1.14 77.47,119.38 C1.1 | C2.1 E2.14 | C5.1 E6.14 25.4,99.06 41.91,99.06 46.99,105.41 C4.1 E5.14 57.15,100.33 67.31,100.33 68.58,99.06 71.12,99.06 C6.1 78.74,100.33 E4.14
W1  (via drill 0.81)
  Top 0.406: E17.9 71.12,33.02 71.12,26.67 v69.85,25.4 | E21.1 20.32,15.24 20.32,26.67 E18.1 19.05,33.02 19.05,41.91 16.51,44.45 16.51,59.69 12.7,63.5 10.16,64.77 10.16,71.12 11.43,72.39 11.43,77.47 15.24,81.28 v15.24,88.9
  Bottom 0.406: E18.1 24.13,26.67 30.48,24.13 36.83,24.13 43.18,21.59 50.8,21.59 52.07,22.86 54.61,24.13 62.23,25.4 v69.85,25.4 | E17.9 68.58,38.1 71.12,38.1 73.66,39.37 104.14,39.37 107.95,35.56 116.84,35.56 U$5.BJ2 | v15.24,88.9 25.4,88.9 E9.12
W1*W5  (via drill 0.81)
  Top 0.406: E3.11 26.67,115.57 20.32,115.57 17.78,113.03 v17.78,107.95 | E15.6 40.64,50.8 40.64,55.88 35.56,59.69 E12.6 29.21,68.58 21.59,68.58 21.59,71.12 33.02,71.12 43.18,81.28 43.18,96.52 45.72,99.06 45.72,109.22 v43.18,111.76 44.45,113.03 53.34,113.03 E2.1 57.15,114.3 76.2,114.3 78.74,116.84 81.28,116.84 82.55,115.57 82.55,111.76 86.36,107.95 100.33,107.95 104.14,104.14 104.14,101.6 | U$5.AK1 116.84,102.87 109.22,102.87 107.95,101.6 104.14,101.6 | 104.14,101.6 97.79,101.6 E4.10
  Bottom 0.406: v17.78,107.95 21.59,106.68 26.67,106.68 E6.11 v43.18,111.76
W2  (via drill 0.81)
  Top 0.406: E14.5 E17.11 | E21.3 25.4,10.16 20.32,10.16 17.78,12.7 17.78,40.64 v16.51,41.91 15.24,43.18 15.24,59.69 12.7,62.23 8.89,63.5 8.89,71.12 10.16,72.39 10.16,77.47 12.7,80.01 12.7,88.9 15.24,91.44 v15.24,106.68 15.24,111.76 20.32,116.84 25.4,116.84 E3.12
  Bottom 0.406: U$5.BV2 117.23,4.2 116.84,3.81 105.41,3.81 99.06,1.27 71.12,1.27 43.18,2.54 27.94,11.43 E21.3 | E14.5 62.23,43.18 44.45,43.18 40.64,41.91 v16.51,41.91 | v15.24,106.68 16.51,105.41 25.4,105.41 E6.12
W3  (via drill 0.81)
  Top 0.406: E21.5 35.56,15.24 39.37,15.24 43.18,19.05 43.18,26.67 41.91,27.94 41.91,33.02 43.18,34.29 v43.18,44.45 43.18,48.26 45.72,50.8 45.72,58.42 44.45,59.69 44.45,76.2 49.53,81.28 49.53,97.79 50.8,99.06 50.8,105.41 E2.2 | v67.31,58.42 E14.9 E14.2
  Bottom 0.406: E15.2 27.94,43.18 40.64,43.18 v43.18,44.45 55.88,44.45 E14.2 | U$5.BE2 116.84,45.72 109.22,45.72 105.41,49.53 105.41,53.34 104.14,55.88 101.6,57.15 95.25,57.15 86.36,59.69 v67.31,58.42
W4  (via drill 0.81)
  Top 0.406: E21.2 21.59,16.51 21.59,25.4 E18.2 20.32,34.29 20.32,41.91 17.78,44.45 17.78,59.69 12.7,64.77 12.7,67.31 11.43,68.58 11.43,71.12 12.7,72.39 12.7,77.47 13.97,78.74 v16.51,78.74 | E8.9 68.58,87.63 68.58,90.17 69.85,91.44 72.39,91.44 v72.39,76.2 74.93,73.66 74.93,68.83 73.66,67.56 73.66,57.15 v74.93,55.88
  Bottom 0.406: v16.51,78.74 20.32,74.93 25.4,74.93 E12.11 33.02,72.39 41.91,72.39 49.53,77.47 53.34,77.47 57.15,73.66 60.96,73.66 v72.39,76.2 77.47,72.39 81.28,72.39 86.36,74.93 101.6,74.93 111.76,80.01 116.84,80.01 U$5.AT2 | E14.12 62.23,50.8 69.85,50.8 v74.93,55.88
W5  (via drill 0.81)
  Top 0.406: v43.18,7.62 44.45,8.89 44.45,27.94 v43.18,29.21 44.45,30.48 44.45,48.26 46.99,50.8 46.99,58.42 45.72,59.69 45.72,76.2 50.8,81.28 v50.8,87.63
  Bottom 0.406: U$5.BU2 117.2,7.26 116.84,7.62 110.49,7.62 109.22,6.35 97.79,2.54 91.44,2.54 86.36,3.81 81.28,3.81 76.2,6.35 72.39,6.35 71.12,5.08 66.04,5.08 v43.18,7.62 | E18.6 36.83,27.94 40.64,27.94 41.91,29.21 v43.18,29.21 45.72,26.67 49.53,26.67 53.34,31.75 62.23,31.75 E17.5 | E8.12 58.42,87.63 v50.8,87.63
W6  (via drill 0.81)
  Top 0.406: E21.12 E18.3 21.59,35.56 21.59,41.91 19.05,44.45 19.05,59.69 13.97,64.77 13.97,67.31 12.7,68.58 12.7,71.12 13.97,72.39 v13.97,76.2 | E6.3 31.75,88.9 38.1,88.9 39.37,87.63 39.37,85.09 38.1,83.82 33.02,83.82 E9.3 | E5.5 v67.31,90.17
  Bottom 0.406: E18.3 31.75,25.4 39.37,25.4 40.64,26.67 43.18,26.67 45.72,24.13 48.26,24.13 53.34,26.67 54.61,26.67 E17.2 | E12.12 25.4,72.39 24.13,72.39 v13.97,76.2 13.97,78.74 15.24,80.01 19.05,80.01 20.32,78.74 20.32,77.47 21.59,76.2 25.4,76.2 E9.3 | U$5.AM2 116.84,96.52 111.76,96.52 104.14,93.98 91.44,91.44 81.28,91.44 73.66,87.63 71.12,87.63 v67.31,90.17 | E6.3 30.48,92.71 36.83,91.44 40.64,91.44 44.45,92.71 62.23,92.71 E5.5
W7  (via drill 0.81)
  Top 0.406: E15.5 39.37,52.07 39.37,54.61 v33.02,59.69 | v48.26,60.96 49.53,62.23 49.53,64.77 46.99,67.31 46.99,69.85 48.26,71.12 48.26,74.93 52.07,78.74 52.07,95.25 v50.8,96.52 52.07,97.79 52.07,104.14 E2.3 60.96,113.03 71.12,113.03 72.39,111.76 72.39,107.95 E5.9
  Bottom 0.406: U$5.AK2 116.84,102.87 111.76,102.87 100.33,106.68 86.36,106.68 81.28,104.14 78.74,104.14 76.2,105.41 73.66,105.41 72.39,104.14 72.39,101.6 71.12,100.33 69.85,100.33 E5.9 | E5.2 55.88,96.52 v50.8,96.52 | v33.02,59.69 38.1,59.69 41.91,62.23 43.18,62.23 v48.26,60.96
W8  (via drill 0.81)
  Top 0.406: E2.6 E5.12 | E18.5 36.83,33.02 39.37,33.02 40.64,34.29 40.64,48.26 43.18,50.8 43.18,57.15 v41.91,58.42 41.91,78.74 44.45,81.28 44.45,95.25 v45.72,96.52 | E3.5 41.91,102.87 41.91,100.33 40.64,99.06 36.83,99.06 E6.5 | v80.01,114.3 80.01,110.49 83.82,106.68 83.82,100.33 E4.2 92.71,99.06 116.84,99.06 U$5.AL1
  Bottom 0.406: E3.5 38.1,116.84 52.07,116.84 53.34,115.57 63.5,115.57 E2.6 69.85,114.3 v80.01,114.3 | E6.5 35.56,92.71 38.1,92.71 40.64,95.25 v45.72,96.52 | E11.5 62.23,59.69 52.07,59.69 49.53,57.15 44.45,57.15 v41.91,58.42
W9  (via drill 0.81)
  Top 0.406: E15.4 E18.11 E18.12 | E11.2 53.34,66.04 53.34,71.12 58.42,76.2 v59.69,76.2 | E8.5 68.58,74.93 71.12,74.93 73.66,72.39 73.66,68.83 72.39,67.56 72.39,49.53 71.12,48.26 v71.12,41.91
  Bottom 0.406: E18.12 E18.11 33.02,39.37 48.26,39.37 50.8,38.1 53.34,38.1 57.15,39.37 63.5,39.37 v71.12,41.91 74.93,43.18 80.01,43.18 83.82,41.91 104.14,41.91 106.68,39.37 109.22,39.37 111.76,41.91 116.84,41.91 U$5.BF2 | E8.5 62.23,76.2 v59.69,76.2

### Text on the board
Bottom: M228A | MARK TRACK DECODER